# EAGLE schematic WiFi DAC (EAGLE 7.6.0)
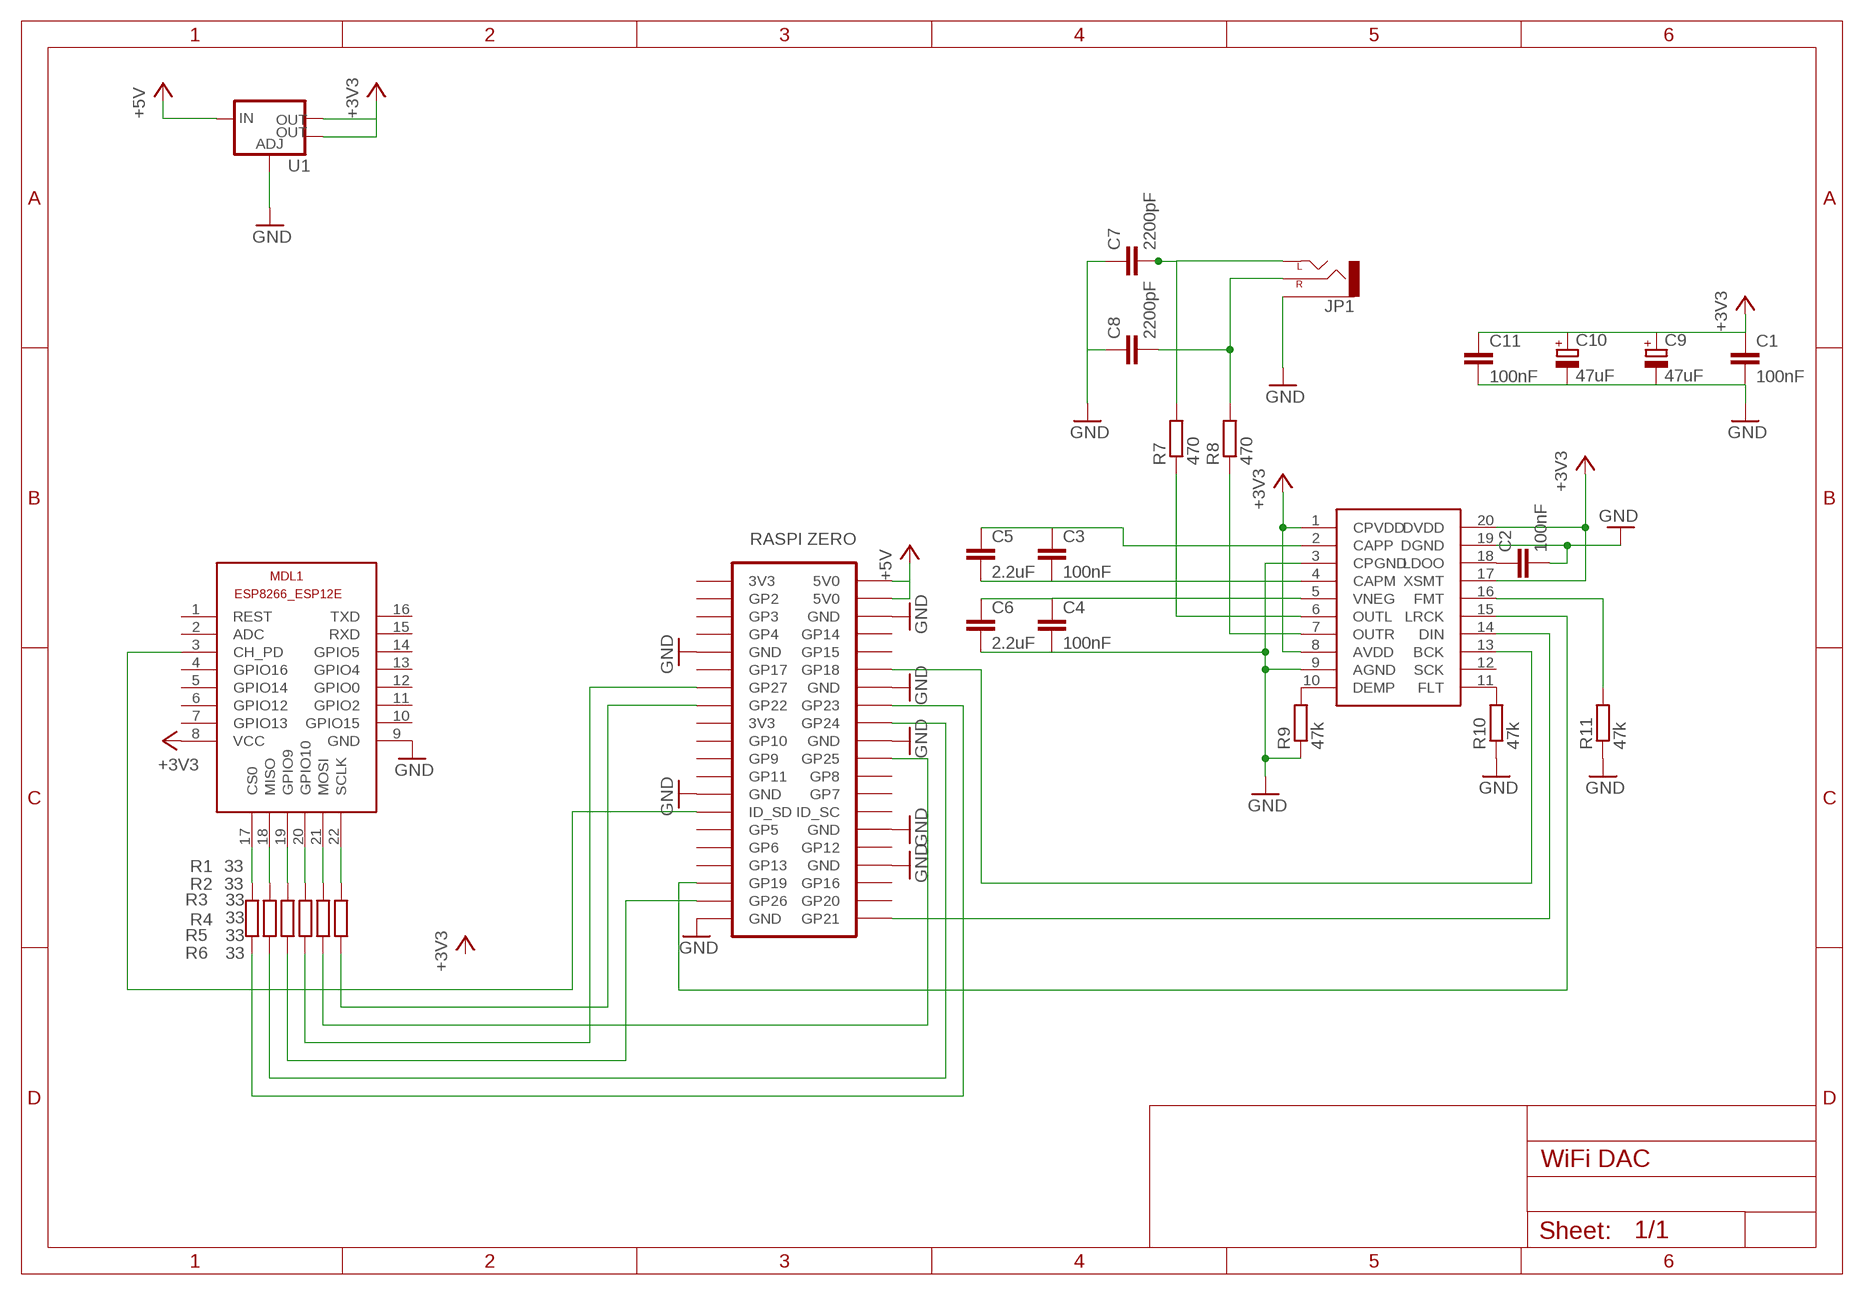
[diagram p0: schematic, sheet 1]

## Parts
C1  100nF  C-EUC0603  [C0603]
C2  100nF  C-EUC0603  [C0603]
C3  100nF  C-EUC0603  [C0603]
C4  100nF  C-EUC0603  [C0603]
C5  2.2uF  C-EUC0603  [C0603]
C6  2.2uF  C-EUC0603  [C0603]
C7  2200pF  C-EUC0603  [C0603]
C8  2200pF  C-EUC0603  [C0603]
C9  47uF  CPOL-EUSANYO_SMD_A5  [SANYO-OSCON_SMD_A5]
C10  47uF  CPOL-EUSANYO_SMD_A5  [SANYO-OSCON_SMD_A5]
C11  100nF  C-EUC0603  [C0603]
JP1  AUDIO-JACKPTH  [AUDIO-JACK]
MDL1  ESP8266-12EESP8266-ESP12E  [ESP8266-ESP12E]
R1  33  R-EU_R0603  [R0603]
R2  33  R-EU_R0603  [R0603]
R3  33  R-EU_R0603  [R0603]
R4  33  R-EU_R0603  [R0603]
R5  33  R-EU_R0603  [R0603]
R6  33  R-EU_R0603  [R0603]
R7  470  R-EU_R0603  [R0603]
R8  470  R-EU_R0603  [R0603]
R9  47k  R-EU_R0603  [R0603]
R10  47k  R-EU_R0603  [R0603]
R11  47k  R-EU_R0603  [R0603]
U1  V_REG_LM1117SOT223  [SOT223]
U$1  ZERO  [ZERO]
U$2  PCM5102  [TSSOP20]

## Nets
+3V3: C1.1 C9.+ C10.+ C11.1 MDL1.8(VCC) U1.2(OUT) U1.4(OUT) U$2.1(CPVDD) U$2.8(AVDD) U$2.17(XSMT) U$2.20(DVDD)
+5V: U1.3(IN) U$1.2(5V0) U$1.4(5V0)
GND: C1.2 C2.2 C4.2 C6.2 C7.1 C8.1 C9.- C10.- C11.2 JP1.SLEEVE MDL1.9(GND) R9.1 R10.1 R11.1 U1.1(ADJ) U$1.6(GND) U$1.9(GND) U$1.14(GND) U$1.20(GND) U$1.25(GND) U$1.30(GND) U$1.34(GND) U$1.39(GND) U$2.3(CPGND) U$2.9(AGND) U$2.19(DGND)
N$1: MDL1.17(CS0) R1.2
N$2: MDL1.18(MISO) R2.2
N$3: MDL1.19(GPIO9) R3.2
N$4: MDL1.20(GPIO10) R4.2
N$5: MDL1.21(MOSI) R5.2
N$6: MDL1.22(SCLK) R6.2
N$7: R1.1 U$1.16(GP23)
N$8: R2.1 U$1.18(GP24)
N$9: R3.1 U$1.37(GP26)
N$10: R4.1 U$1.13(GP27)
N$11: R5.1 U$1.22(GP25)
N$12: R6.1 U$1.15(GP22)
N$13: MDL1.3(CH_PD) U$1.27(ID_SD)
N$14: U$1.35(GP19) U$2.15(LRCK)
N$15: U$1.40(GP21) U$2.14(DIN)
N$16: U$1.12(GP18) U$2.13(BCK)
N$17: C2.1 U$2.18(LDOO)
N$18: C3.2 C5.2 U$2.4(CAPM)
N$19: C3.1 C5.1 U$2.2(CAPP)
N$20: C4.1 C6.1 U$2.5(VNEG)
N$21: C7.2 JP1.TIP(LEFT) R7.2
N$22: C8.2 JP1.RING(RIGHT) R8.2
N$23: R7.1 U$2.6(OUTL)
N$24: R8.1 U$2.7(OUTR)
N$25: R9.2 U$2.10(DEMP)
N$26: R10.2 U$2.11(FLT)
N$27: R11.2 U$2.16(FMT)
Unconnected: MDL1.1(REST) MDL1.2(ADC) MDL1.4(GPIO16) MDL1.5(GPIO14) MDL1.6(GPIO12) MDL1.7(GPIO13) MDL1.10(GPIO15) MDL1.11(GPIO2) MDL1.12(GPIO0) MDL1.13(GPIO4) MDL1.14(GPIO5) MDL1.15(RXD) MDL1.16(TXD) U$1.1(3V3) U$1.3(GP2) U$1.5(GP3) U$1.7(GP4) U$1.8(GP14) U$1.10(GP15) U$1.11(GP17) U$1.17(3V3) U$1.19(GP10) U$1.21(GP9) U$1.23(GP11) U$1.24(GP8) U$1.26(GP7) U$1.28(ID_SC) U$1.29(GP5) U$1.31(GP6) U$1.32(GP12) U$1.33(GP13) U$1.36(GP16) U$1.38(GP20) U$2.12(SCK)

## Library data of the parts
C1-C8 C11 = rcl:C-EU: CAPACITOR, European symbol
C9 C10 = rcl:CPOL-EU: POLARIZED CAPACITOR, European symbol
JP1 = SparkFun-Connectors:AUDIO-JACK: 3.5mm Audio Jack Simple 3.5mm common PCB mount audio jack. Variant PTH is our storefront SKU PRT-08032
MDL1 = ESP12E:ESP8266-12E: ESP8266-12E with additional I/O and GPIO04/05 corrected The author cannot warrant that this library is free from error or will meet your specific requirements. Created by PuceBaboon.com. Komagane, Nagano, JAPAN
R1-R11 = rcl:R-EU_: RESISTOR, European symbol
U1 = SparkFun-PowerIC:V_REG_LM1117: Voltage Regulator LM1117 Standard adjustable voltage regulator but in SMD form. Spark Fun Electronics SKU : COM-00595; PROD_ID: VREG-08170
U$1 = RasPi:ZERO: Raspbery Pi Foundation Zero https://www.raspberrypi.org/products/pi-zero/
U$2 = PCM5102:PCM5102